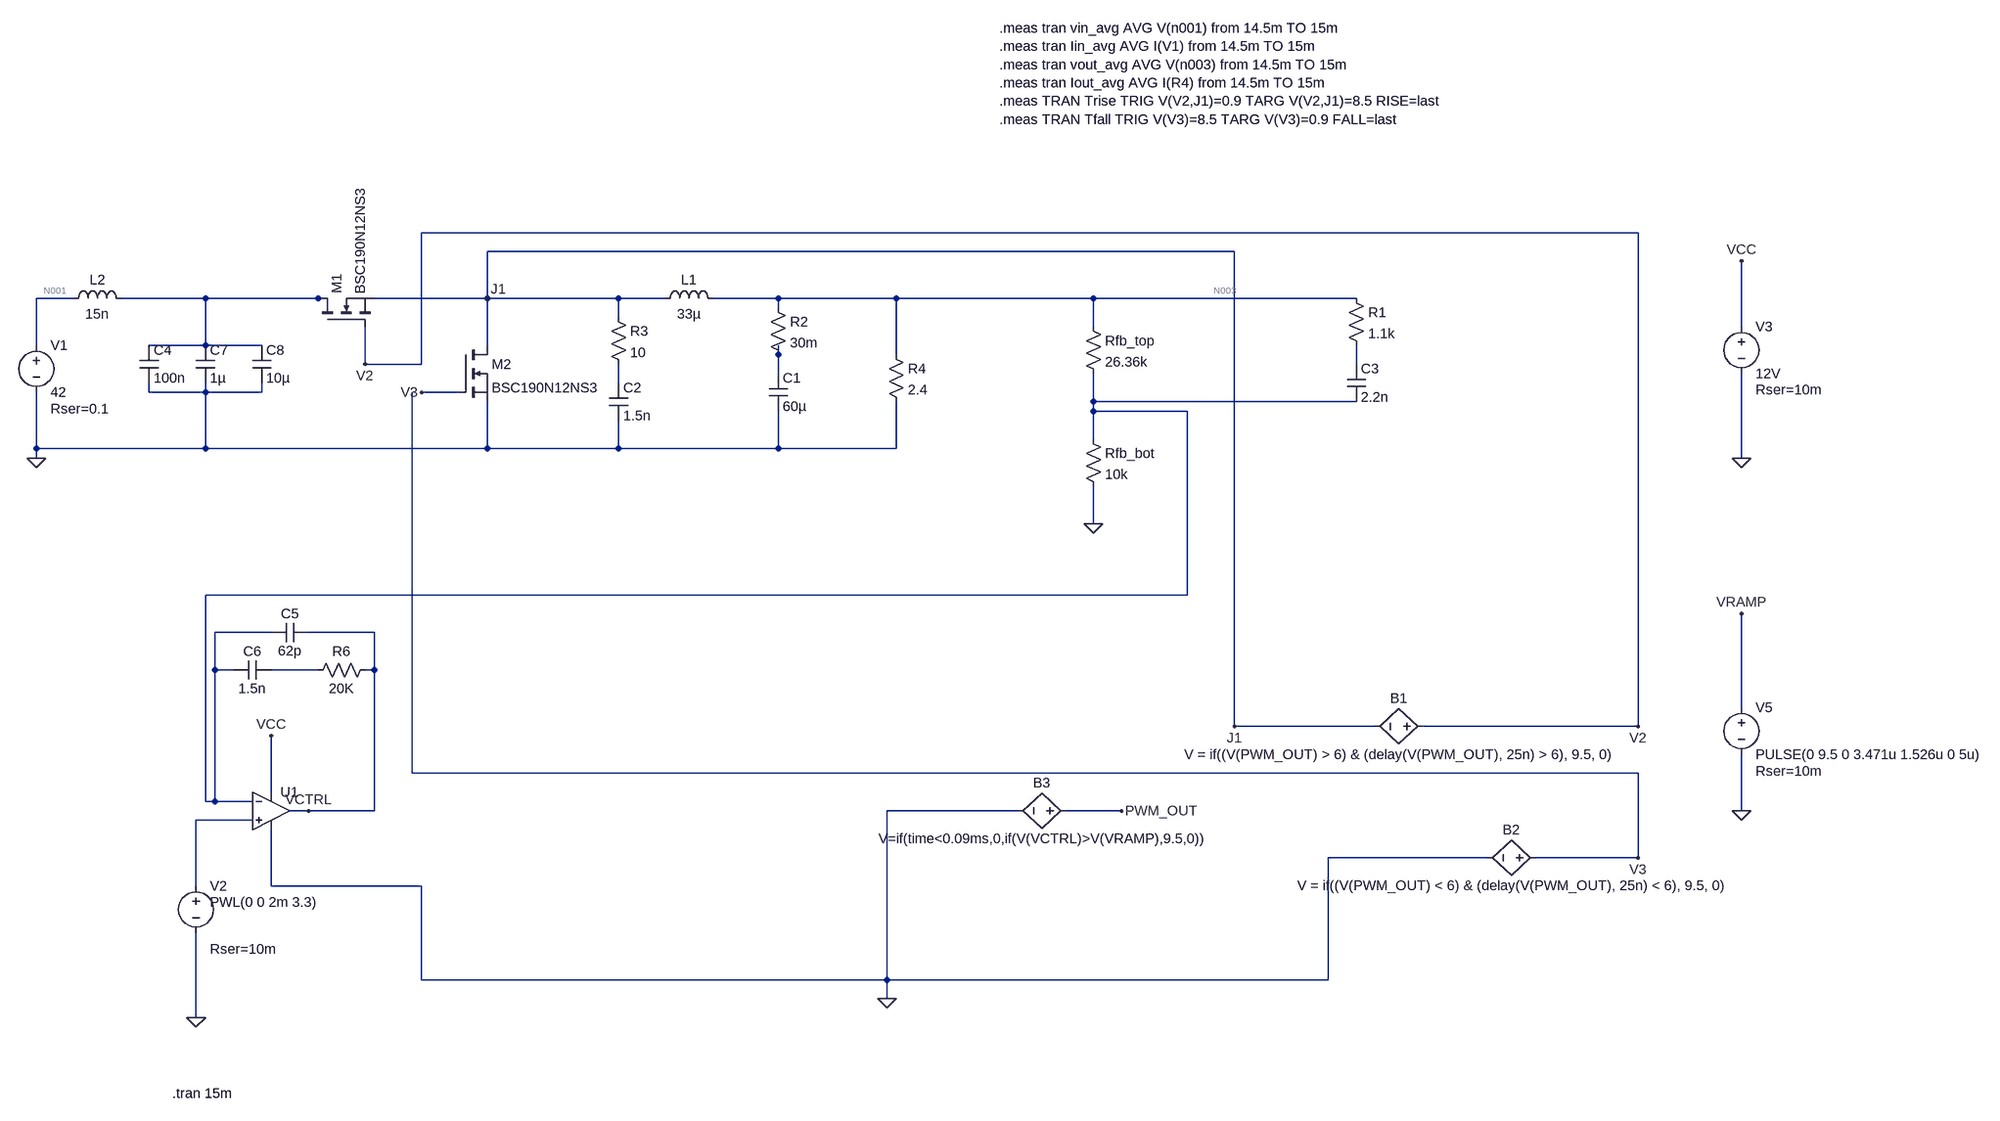
[diagram p0: schematic 60W Voltage controlled closed loop synchronous buck converter with type3 compensation.asc]
60W Voltage controlled closed loop synchronous buck converter with type3 compensation.asc, the LTspice schematic file:
Version 4.1
SHEET 1 3360 1636
WIRE 1968 -144 -160 -144
WIRE 1280 -112 -48 -112
WIRE -752 -32 -816 -32
WIRE -528 -32 -672 -32
WIRE -336 -32 -528 -32
WIRE -320 -32 -336 -32
WIRE -48 -32 -48 -112
WIRE -48 -32 -240 -32
WIRE 176 -32 -48 -32
WIRE 256 -32 176 -32
WIRE 448 -32 336 -32
WIRE 704 -32 448 -32
WIRE 1040 -32 704 -32
WIRE 1488 -32 1040 -32
WIRE 448 -16 448 -32
WIRE 176 0 176 -32
WIRE 1040 16 1040 -32
WIRE 2144 16 2144 -96
WIRE -816 48 -816 -32
WIRE -528 48 -528 -32
WIRE -528 48 -624 48
WIRE -432 48 -528 48
WIRE -48 48 -48 -32
WIRE 448 64 448 48
WIRE 704 64 704 -32
WIRE -256 80 -256 16
WIRE -160 80 -160 -144
WIRE -160 80 -256 80
WIRE 1488 80 1488 48
WIRE 448 96 448 64
WIRE 176 112 176 80
WIRE -624 128 -624 112
WIRE -528 128 -528 112
WIRE -528 128 -624 128
WIRE -432 128 -432 112
WIRE -432 128 -528 128
WIRE -96 128 -160 128
WIRE 1040 144 1040 96
WIRE 1488 144 1040 144
WIRE 1040 160 1040 144
WIRE 1200 160 1040 160
WIRE 1040 208 1040 160
WIRE -816 224 -816 128
WIRE -528 224 -528 128
WIRE -528 224 -816 224
WIRE -48 224 -48 144
WIRE -48 224 -528 224
WIRE 176 224 176 176
WIRE 176 224 -48 224
WIRE 448 224 448 160
WIRE 448 224 176 224
WIRE 704 224 704 144
WIRE 704 224 448 224
WIRE -816 240 -816 224
WIRE 2144 240 2144 96
WIRE 1040 352 1040 288
WIRE 1200 480 1200 160
WIRE 1200 480 -528 480
WIRE -416 544 -512 544
WIRE -240 544 -352 544
WIRE -512 608 -512 544
WIRE -480 608 -512 608
WIRE -336 608 -416 608
WIRE -240 608 -240 544
WIRE -240 608 -256 608
WIRE 2144 672 2144 512
WIRE 1280 704 1280 -112
WIRE 1520 704 1280 704
WIRE 1968 704 1968 -144
WIRE 1968 704 1600 704
WIRE -176 784 -176 128
WIRE 1968 784 -176 784
WIRE -416 816 -416 720
WIRE -528 832 -528 480
WIRE -512 832 -512 608
WIRE -512 832 -528 832
WIRE -448 832 -512 832
WIRE -352 848 -384 848
WIRE -240 848 -240 608
WIRE -240 848 -352 848
WIRE 912 848 688 848
WIRE 1088 848 992 848
WIRE 2144 848 2144 752
WIRE -448 864 -544 864
WIRE 1712 928 1440 928
WIRE 1968 928 1968 784
WIRE 1968 928 1792 928
WIRE -544 976 -544 864
WIRE -416 976 -416 880
WIRE -160 976 -416 976
WIRE -160 1136 -160 976
WIRE 688 1136 688 848
WIRE 688 1136 -160 1136
WIRE 1440 1136 1440 928
WIRE 1440 1136 688 1136
WIRE 688 1168 688 1136
WIRE -544 1200 -544 1056
FLAG -256 80 V2
FLAG -160 128 V3
FLAG -48 -32 J1
FLAG 1040 352 0
FLAG -416 720 VCC
FLAG 1968 704 V2
FLAG 1968 928 V3
FLAG 1088 848 PWM_OUT
FLAG 1280 704 J1
FLAG 688 1168 0
FLAG -352 848 VCTRL
FLAG -544 1200 0
FLAG -816 240 0
FLAG 2144 -96 VCC
FLAG 2144 240 0
FLAG 2144 848 0
FLAG 2144 512 VRAMP
SYMBOL ind 240 -16 R270
WINDOW 0 32 56 VTop 2
WINDOW 3 5 56 VBottom 2
SYMATTR InstName L1
SYMATTR Value 33µ
SYMATTR SpiceLine Rser=10m
SYMBOL cap 432 96 R0
SYMATTR InstName C1
SYMATTR Value 60µ
SYMBOL res 432 -32 R0
SYMATTR InstName R2
SYMATTR Value 30m
SYMBOL res 160 -16 R0
SYMATTR InstName R3
SYMATTR Value 10
SYMBOL cap 160 112 R0
SYMATTR InstName C2
SYMATTR Value 1.5n
SYMBOL nmos -96 48 R0
SYMATTR InstName M2
SYMATTR Value BSC190N12NS3
SYMBOL res 1024 0 R0
SYMATTR InstName Rfb_top
SYMATTR Value 26.36k
SYMBOL res 1024 192 R0
SYMATTR InstName Rfb_bot
SYMATTR Value 10k
SYMBOL OpAmps\\UniversalOpAmp2 -416 848 R0
SYMATTR InstName U1
SYMBOL bv 1808 928 R90
WINDOW 0 -32 56 VBottom 2
WINDOW 3 32 56 VTop 2
SYMATTR InstName B2
SYMATTR Value V = if((V(PWM_OUT) < 6) & (delay(V(PWM_OUT), 25n) < 6), 9.5, 0)
SYMBOL bv 1616 704 R90
WINDOW 0 -32 56 VBottom 2
WINDOW 3 32 56 VTop 2
SYMATTR InstName B1
SYMATTR Value V = if((V(PWM_OUT) > 6) & (delay(V(PWM_OUT), 25n) > 6), 9.5, 0)
SYMBOL nmos -336 16 R270
SYMATTR InstName M1
SYMATTR Value BSC190N12NS3
SYMBOL bv 1008 848 R90
WINDOW 0 -32 56 VBottom 2
WINDOW 3 32 56 VTop 2
SYMATTR InstName B3
SYMATTR Value V=if(time<0.09ms,0,if(V(VCTRL)>V(VRAMP),9.5,0))
SYMBOL res -240 592 R90
WINDOW 0 0 56 VBottom 2
WINDOW 3 32 56 VTop 2
SYMATTR InstName R6
SYMATTR Value 20K
SYMBOL cap -352 528 R90
WINDOW 0 0 32 VBottom 2
WINDOW 3 32 32 VTop 2
SYMATTR InstName C5
SYMATTR Value 62p
SYMBOL cap -416 592 R90
WINDOW 0 0 32 VBottom 2
WINDOW 3 32 32 VTop 2
SYMATTR InstName C6
SYMATTR Value 1.5n
SYMBOL voltage -544 960 R0
WINDOW 123 0 0 Left 0
WINDOW 39 24 124 Left 2
WINDOW 3 24 44 Left 2
SYMATTR SpiceLine Rser=10m
SYMATTR Value PWL(0 0 2m 3.3)
SYMATTR InstName V2
SYMBOL cap -640 48 R0
SYMATTR InstName C4
SYMATTR Value 100n
SYMATTR SpiceLine Rser=10m
SYMBOL cap -544 48 R0
SYMATTR InstName C7
SYMATTR Value 1µ
SYMATTR SpiceLine Rser=5m
SYMBOL cap -448 48 R0
SYMATTR InstName C8
SYMATTR Value 10µ
SYMATTR SpiceLine Rser=10m
SYMBOL voltage -816 32 R0
WINDOW 123 0 0 Left 0
WINDOW 39 24 124 Left 2
SYMATTR SpiceLine Rser=0.1
SYMATTR InstName V1
SYMATTR Value 42
SYMBOL ind -768 -16 R270
WINDOW 0 32 56 VTop 2
WINDOW 3 5 56 VBottom 2
SYMATTR InstName L2
SYMATTR Value 15n
SYMATTR SpiceLine Rser=1m
SYMBOL voltage 2144 0 R0
WINDOW 123 0 0 Left 0
WINDOW 39 24 124 Left 2
SYMATTR SpiceLine Rser=10m
SYMATTR InstName V3
SYMATTR Value 12V
SYMBOL voltage 2144 656 R0
WINDOW 123 0 0 Left 0
WINDOW 39 24 124 Left 2
SYMATTR SpiceLine Rser=10m
SYMATTR InstName V5
SYMATTR Value PULSE(0 9.5 0 3.471u 1.526u 0 5u)
SYMBOL res 688 48 R0
SYMATTR InstName R4
SYMATTR Value 2.4
SYMBOL res 1472 -48 R0
SYMATTR InstName R1
SYMATTR Value 1.1k
SYMBOL cap 1472 80 R0
SYMATTR InstName C3
SYMATTR Value 2.2n
TEXT 880 -1120 Left 2 !.meas tran vin_avg AVG V(n001) from 14.5m TO 15m\n.meas tran Iin_avg AVG I(V1) from 14.5m TO 15m\n.meas tran vout_avg AVG V(n003) from 14.5m TO 15m\n.meas tran Iout_avg AVG I(R4) from 14.5m TO 15m\n.meas TRAN Trise TRIG V(V2,J1)=0.9 TARG V(V2,J1)=8.5 RISE=last\n.meas TRAN Tfall TRIG V(V3)=8.5 TARG V(V3)=0.9 FALL=last
TEXT -584 1416 Left 2 !.tran 15m

The netlist it stands for:
* 60W Voltage controlled closed loop synchronous buck converter with type3 compensation.asc
L1 J1 N003 33µ Rser=10m
C1 N004 0 60µ
R2 N003 N004 30m
R3 J1 N006 10
C2 N006 0 1.5n
M2 J1 V3 0 0 BSC190N12NS3
Rfb_top N003 N007 26.36k
Rfb_bot N007 0 10k
X§U1 N009 N007 VCC 0 VCTRL level2 Avol=1Meg GBW=10Meg Slew=10Meg Ilimit=25m Rail=0 Vos=0 En=0 Enk=0 In=0 Ink=0 Rin=500Meg  ; pins In+ In- V+ V- OUT
B2 V3 0 V = if((V(PWM_OUT) < 6) & (delay(V(PWM_OUT), 25n) < 6), 9.5, 0)
B1 V2 J1 V = if((V(PWM_OUT) > 6) & (delay(V(PWM_OUT), 25n) > 6), 9.5, 0)
M1 N002 V2 J1 J1 BSC190N12NS3
B3 PWM_OUT 0 V=if(time<0.09ms,0,if(V(VCTRL)>V(VRAMP),9.5,0))
R6 VCTRL N008 20K
C5 VCTRL N007 62p
C6 N008 N007 1.5n
V2 N009 0 PWL(0 0 2m 3.3) Rser=10m
C4 N002 0 100n Rser=10m
C7 N002 0 1µ Rser=5m
C8 N002 0 10µ Rser=10m
V1 N001 0 42 Rser=0.1
L2 N001 N002 15n Rser=1m
V3 VCC 0 12V Rser=10m
V5 VRAMP 0 PULSE(0 9.5 0 3.471u 1.526u 0 5u) Rser=10m
R4 N003 0 2.4
R1 N003 N005 1.1k
C3 N005 N007 2.2n
.model NMOS NMOS
.model PMOS PMOS
.lib standard.mos
.meas tran vin_avg AVG V(n001) from 14.5m TO 15m
.meas tran Iin_avg AVG I(V1) from 14.5m TO 15m
.meas tran vout_avg AVG V(n003) from 14.5m TO 15m
.meas tran Iout_avg AVG I(R4) from 14.5m TO 15m
.meas TRAN Trise TRIG V(V2,J1)=0.9 TARG V(V2,J1)=8.5 RISE=last
.meas TRAN Tfall TRIG V(V3)=8.5 TARG V(V3)=0.9 FALL=last
.tran 15m
.lib UniversalOpAmp2.lib
.backanno
.end